# Altium schematic sheet Sheet9.SchDoc
size A4
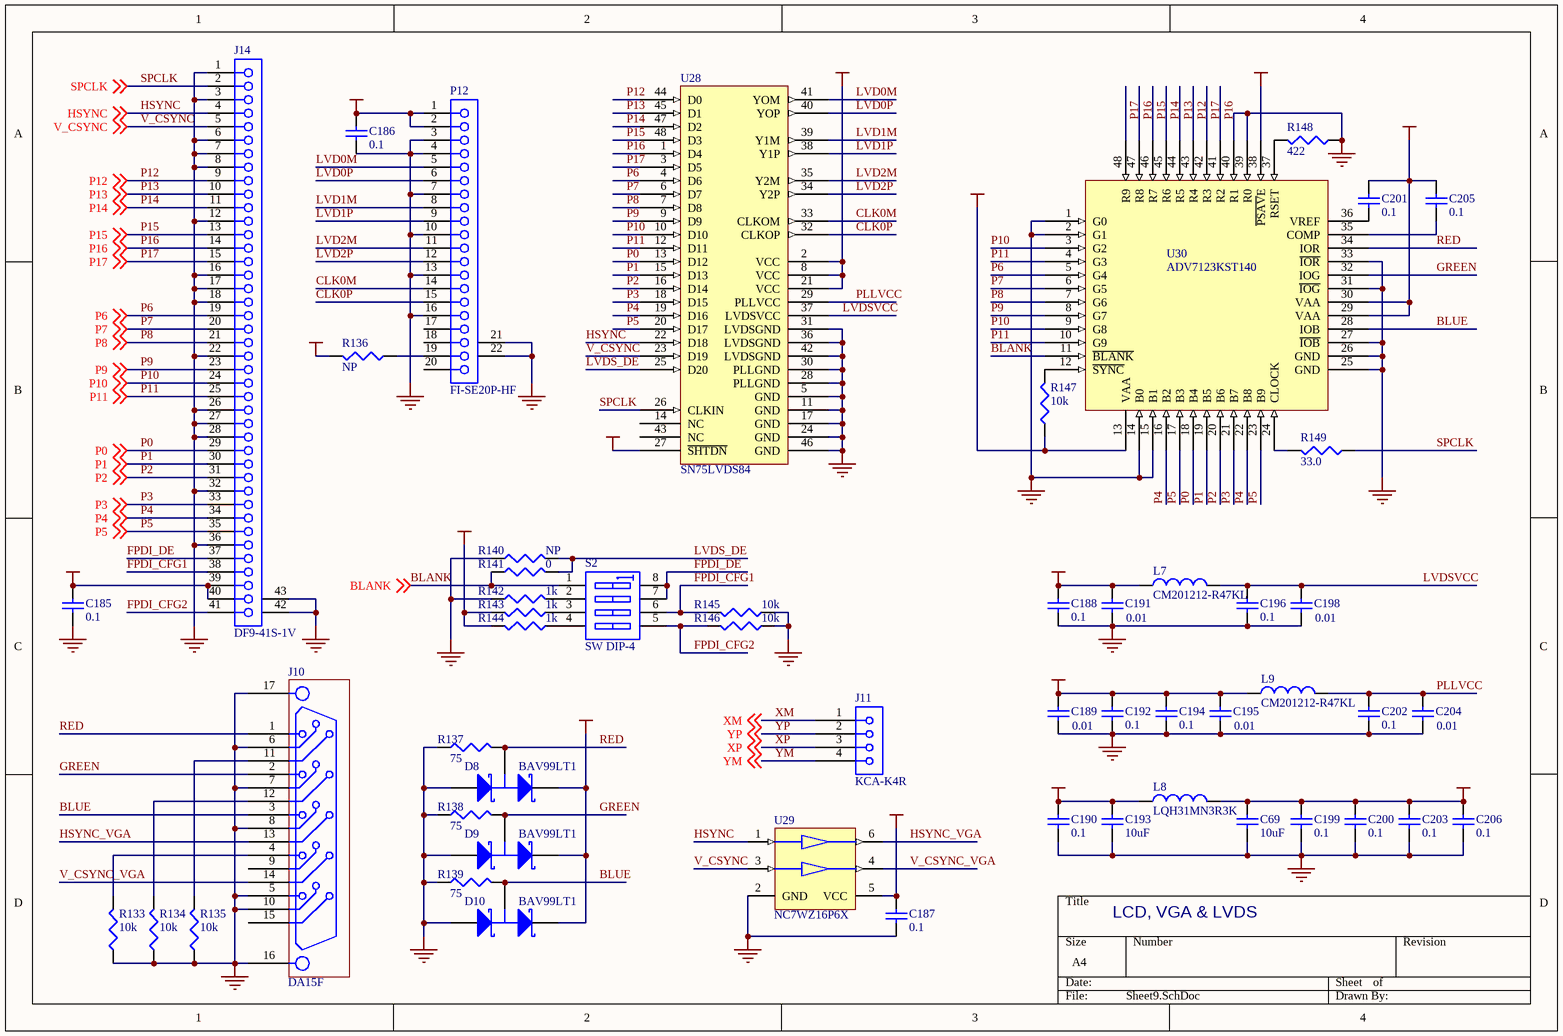
[diagram p0: Sheet9.SchDoc]

## Parts
C69  10uF  [1206]
C185  0.1  [0603]
C186  0.1  [0603]
C187  0.1  [0603]
C188  0.1  [0603]
C189  0.01  [0603]
C190  0.1  [0603]
C191  0.01  [0603]
C192  0.1  [0603]
C193  10uF  [1206]
C194  0.1  [0603]
C195  0.01  [0603]
C196  0.1  [0603]
C198  0.01  [0603]
C199  0.1  [0603]
C200  0.1  [0603]
C201  0.1  [0603]
C202  0.1  [0603]
C203  0.1  [0603]
C204  0.01  [0603]
C205  0.1  [0603]
C206  0.1  [0603]
D8  BAV99LT1  [SOT23]
D9  BAV99LT1  [SOT23]
D10  BAV99LT1  [SOT23]
J10  DA15F  [DA15F]
J11  KCA-K4R  [KCAK4R]
J14  DF9-41S-1V  [DF9-41S-1V]
L7  CM201212-R47KL  [INDC2012-0805]
L8  LQH31MN3R3K  [INDC3216-1206]
L9  CM201212-R47KL  [INDC2012-0805]
P12  FI-SE20P-HF  [FI-SE20P-HF]
R133  10k  [CR1608-0603]
R134  10k  [CR1608-0603]
R135  10k  [CR1608-0603]
R136  NP  [CR1608-0603]
R137  75  [CR1608-0603]
R138  75  [CR1608-0603]
R139  75  [CR1608-0603]
R140  NP  [CR1608-0603]
R141  0  [CR1608-0603]
R142  1k  [CR1608-0603]
R143  1k  [CR1608-0603]
R144  1k  [CR1608-0603]
R145  10k  [CR1608-0603]
R146  10k  [CR1608-0603]
R147  10k  [CR1608-0603]
R148  422  [CR1608-0603]
R149  value 33.0  [CR1608-0603]  (hidden comment: 33)
S2  SW DIP-4  [SO-G8/D6.6]
U28  SN75LVDS84  [TSSO12x8-48]
U29  NC7WZ16P6X  [SC88]
U30  ADV7123KST140  [48A]

## Nets
GND: C69.1 C185.2 C186.2 C187.2 C188.2 C189.1 C190.2 C191.1 C192.2 C193.1 C194.2 C195.1 C196.2 C198.1 C199.2 C200.2 C202.2 C203.2 C204.1 C206.2 D8.1(A) D9.1(A) D10.1(A) J10.5 J10.6 J10.7 J10.8 J10.10 J10.16 J10.17 J14.1 J14.3 J14.6 J14.7 J14.8 J14.12 J14.16 J14.17 J14.18 J14.22 J14.26 J14.27 J14.28 J14.32 J14.36 J14.42(MH2) J14.43(MH1) P12.3 P12.4 P12.7 P12.10 P12.13 P12.16 P12.21 P12.22 R133.1 R134.1 R135.1 R137.1 R138.1 R139.1 R140.1 R142.1 R145.1 R146.1 R148.1 U28.5(GND) U28.11(GND) U28.17(GND) U28.24(GND) U28.28(PLLGND) U28.30(PLLGND) U28.31(LVDSGND) U28.36(LVDSGND) U28.42(LVDSGND) U28.46(GND) U29.2(GND) U30.1(G0) U30.2(G1) U30.14(B0) U30.15(B1) U30.25(GND) U30.26(GND) U30.27(~{IOB}) U30.31(~{IOG}) U30.33(~{IOR}) U30.39(R0) U30.40(R1)
VCC5V0: C190.1 C193.2 L8.1
VCC5V0_VGA: C69.2 C187.1 C199.1 C200.1 C201.1 C203.1 C205.1 C206.1 D8.2(K) D9.2(K) D10.2(K) L8.2 R147.1 U29.5(VCC) U30.13(VAA) U30.29(VAA) U30.30(VAA) U30.38(~{PSAV}E)
VCCIO: C185.1 C186.1 C188.1 C189.2 C191.2 C192.1 C194.1 C195.2 J14.39 J14.40 L7.1 L9.1 P12.1 P12.2 R136.2 R143.2 R144.2 U28.2(VCC) U28.8(VCC) U28.21(VCC) U28.27(~{SHTDN})
BLANK: R141.1 S2.1(A1) U30.11(~{BLANK}) ; off-sheet BLANK
BLUE: D10.3(C) J10.3 R139.2 U30.28(IOB)
CLK0M: P12.14 U28.33(CLKOM)
CLK0P: P12.15 U28.32(CLKOP)
FPDI_CFG1: J14.38 R145.2 S2.6(B3)
FPDI_CFG2: J14.41 R146.2 S2.5(B4)
FPDI_DE: J14.37 S2.7(B2) S2.8(B1)
GREEN: D9.3(C) J10.2 R138.2 U30.32(IOG)
HSYNC: J14.4 U28.22(D18) U29.1(A) ; off-sheet HSYNC
HSYNC_VGA: J10.13 U29.6(Y)
LVD0M: P12.5 U28.41(YOM)
LVD0P: P12.6 U28.40(YOP)
LVD1M: P12.8 U28.39(Y1M)
LVD1P: P12.9 U28.38(Y1P)
LVD2M: P12.11 U28.35(Y2M)
LVD2P: P12.12 U28.34(Y2P)
LVDS_DE: R140.2 R141.2 U28.25(D20)
LVDSVCC: C196.1 C198.2 L7.2 U28.37(LVDSVCC)
P0: J14.29 U28.13(D12) U30.18(B4) ; off-sheet P0
P1: J14.30 U28.15(D13) U30.19(B5) ; off-sheet P1
P2: J14.31 U28.16(D14) U30.20(B6) ; off-sheet P2
P3: J14.33 U28.18(D15) U30.21(B7) ; off-sheet P3
P4: J14.34 U28.19(D16) U30.16(B2) U30.22(B8) ; off-sheet P4
P5: J14.35 U28.20(D17) U30.17(B3) U30.23(B9) ; off-sheet P5
P6: J14.19 U28.4(D6) U30.5(G4) ; off-sheet P6
P7: J14.20 U28.6(D7) U30.6(G5) ; off-sheet P7
P8: J14.21 U28.7(D8) U30.7(G6) ; off-sheet P8
P9: J14.23 U28.9(D9) U30.8(G7) ; off-sheet P9
P10: J14.24 U28.10(D10) U30.3(G2) U30.9(G8) ; off-sheet P10
P11: J14.25 U28.12(D11) U30.4(G3) U30.10(G9) ; off-sheet P11
P12: J14.9 U28.44(D0) U30.43(R4) ; off-sheet P12
P13: J14.10 U28.45(D1) U30.44(R5) ; off-sheet P13
P14: J14.11 U28.47(D2) U30.45(R6) ; off-sheet P14
P15: J14.13 U28.48(D3) U30.46(R7) ; off-sheet P15
P16: J14.14 U28.1(D4) U30.41(R2) U30.47(R8) ; off-sheet P16
P17: J14.15 U28.3(D5) U30.42(R3) U30.48(R9) ; off-sheet P17
PLLVCC: C202.1 C204.2 L9.2 U28.29(PLLVCC)
RED: D8.3(C) J10.1 R137.2 U30.34(IOR)
SPCLK: J14.2 R149.1 U28.26(CLKIN) ; off-sheet SPCLK
V_CSYNC: J14.5 U28.23(D19) U29.3(B) ; off-sheet V_CSYNC
V_CSYNC_VGA: J10.14 U29.4(Y)
XM: J11.1 ; off-sheet XM
XP: J11.3 ; off-sheet XP
YM: J11.4 ; off-sheet YM
YP: J11.2 ; off-sheet YP
NetC201_2: C201.2 U30.36(VREF)
NetC205_2: C205.2 U30.35(COMP)
NetJ10_4: J10.4 R133.2
NetJ10_11: J10.11 R135.2
NetJ10_12: J10.12 R134.2
NetP12_19: P12.19 R136.1
NetR142_2: R142.2 S2.2(A2)
NetR143_1: R143.1 S2.3(A3)
NetR144_1: R144.1 S2.4(A4)
NetR147_2: R147.2 U30.12(~{SYNC})
NetR148_2: R148.2 U30.37(RSET)
NetR149_2: R149.2 U30.24(CLOCK)

Not connected (* = marked no-connect by the designer): J10 9 15; P12 17 18 20; U28 14(NC) 43(NC)

## Notes on the sheet
- LCD, VGA & LVDS

## Library data of the parts
C69 C193 = C1206: Ceramic Chip Capacitor - Standard; Published: 17-Jul-2002; LatestRevisionDate: 19-Mar-2004; LatestRevisionNote: Silkscreen size reduced.; DatasheetDocument: Mar-2001; PackageDocument: Mar-2001; PackageReference: 1206; Publisher: Altium Limited; Code_JEITA: 1206; Code_IPC: 3216 [1206]; ComponentLink1Description: Manufacturer Link; ComponentLink1URL: http://www.kemet.com/; ComponentLink2Description: Datasheet; ComponentLink2URL: http://www.kemet.com/kemet/web/homepage/kechome.nsf/vapubfilesname/F3102TA.pdf/$file/F3102TA.pdf; Value: 10uF
C185-C192 C194-C196 C198-C206 = C0603: Ceramic Chip Capacitor - Standard; Note: Footprint corresponds to dimensions for bulk cassette packaging. This case size has tightened tolerances.; Published: 17-Jul-2002; LatestRevisionDate: 19-Mar-2004; LatestRevisionNote: Silkscreen size reduced.; DatasheetDocument: Mar-2001; PackageDocument: Mar-2001; PackageReference: 0603; Publisher: Altium Limited; Code_JEITA: 0603; Code_IPC: 1608 [0603]; ComponentLink1Description: Manufacturer Link; ComponentLink1URL: http://www.kemet.com/; ComponentLink2Description: Datasheet; ComponentLink2URL: http://www.kemet.com/kemet/web/homepage/kechome.nsf/vapubfilesname/F3102TA.pdf/$file/F3102TA.pdf
  C185-C188 C190 C192 C194 C196 C199-C203 C205 C206: Value: 0.1
  C189 C191 C195 C198 C204: Value: 0.01
D8-D10 = BAS40-04: Schottky Barrier Double Diode; Published: 17-Sep-2003; DatasheetDocument: 10-Feb-2001; PackageDocument: May-1999; PackageReference: SOT23; Publisher: Altium Limited; ComponentLink1Description: Manufacturer Link; ComponentLink1URL: http://www.semiconductors.philips.com/; ComponentLink2Description: Datasheet; ComponentLink2URL: http://www.semiconductors.philips.com/acrobat/datasheets/BAS40_SERIES_5.pdf
J10 = DA15F: 15pin DSUB High Density Female
J11 = KCAK4R: Connector for ASTTouch Screen
J14 = DF9-41S-1V: 1mm Pitch SMT VESA FPDI-1
L7-L9 = Inductor: Published: 8-Jun-2000; Revision: July-2002: Re-released for DXP Platform.; Publisher: Altium Limited
  L7 L9: Value: CM201212-R47KL
  L8: Value: LQH31MN3R3K
P12 = FI-SE20P-HF: 20PIN 1.25mm pitch
R133-R149 = Res3: Resistor; Published: 8-Jun-2000; Revision: July-2002: Re-released for DXP Platform.; Publisher: Altium Limited
  R133-R135 R145-R147: Value: 10k
  R136 R140: Value: NP
  R137-R139: Value: 75
  R141: Value: 0
  R142-R144: Value: 1k
  R148: Value: 422
S2 = SW DIP-4: DIP Switch, 4 Position, SPST; Published: 24-Mar-1999; LatestRevisionDate: 17-Jul-2002; LatestRevisionNote: Re-released for DXP Platform.; Publisher: Altium Limited; Code_JEDEC: MS-012-AA; Code_IPC: SO8
U28 = SN75LVDS84: LVDS 18-Bit Color Flat Panel Display (FPD) Link
U29 = NC7WZ16P6X: TinyLogic UHS Dual Buffer
U30 = ADV7123: Triple 10-Bit High Speed Video DAC